# Altium schematic sheet [5] Jetson Nano P1.SchDoc: ARS Camera REV01 Jetson Nano P1
size A3; DrawnBy: Manh Ngo Van; Engineer: Manh Ngo Van; Organization: Altium Limited; Address1: L3, 12a Rodborough Rd; Address2: Frenchs Forest; Address3: NSW; Address4: Australia 2086; DocumentNumber: 5; Revision: 1.0; SheetNumber: 5; SheetTotal: 16
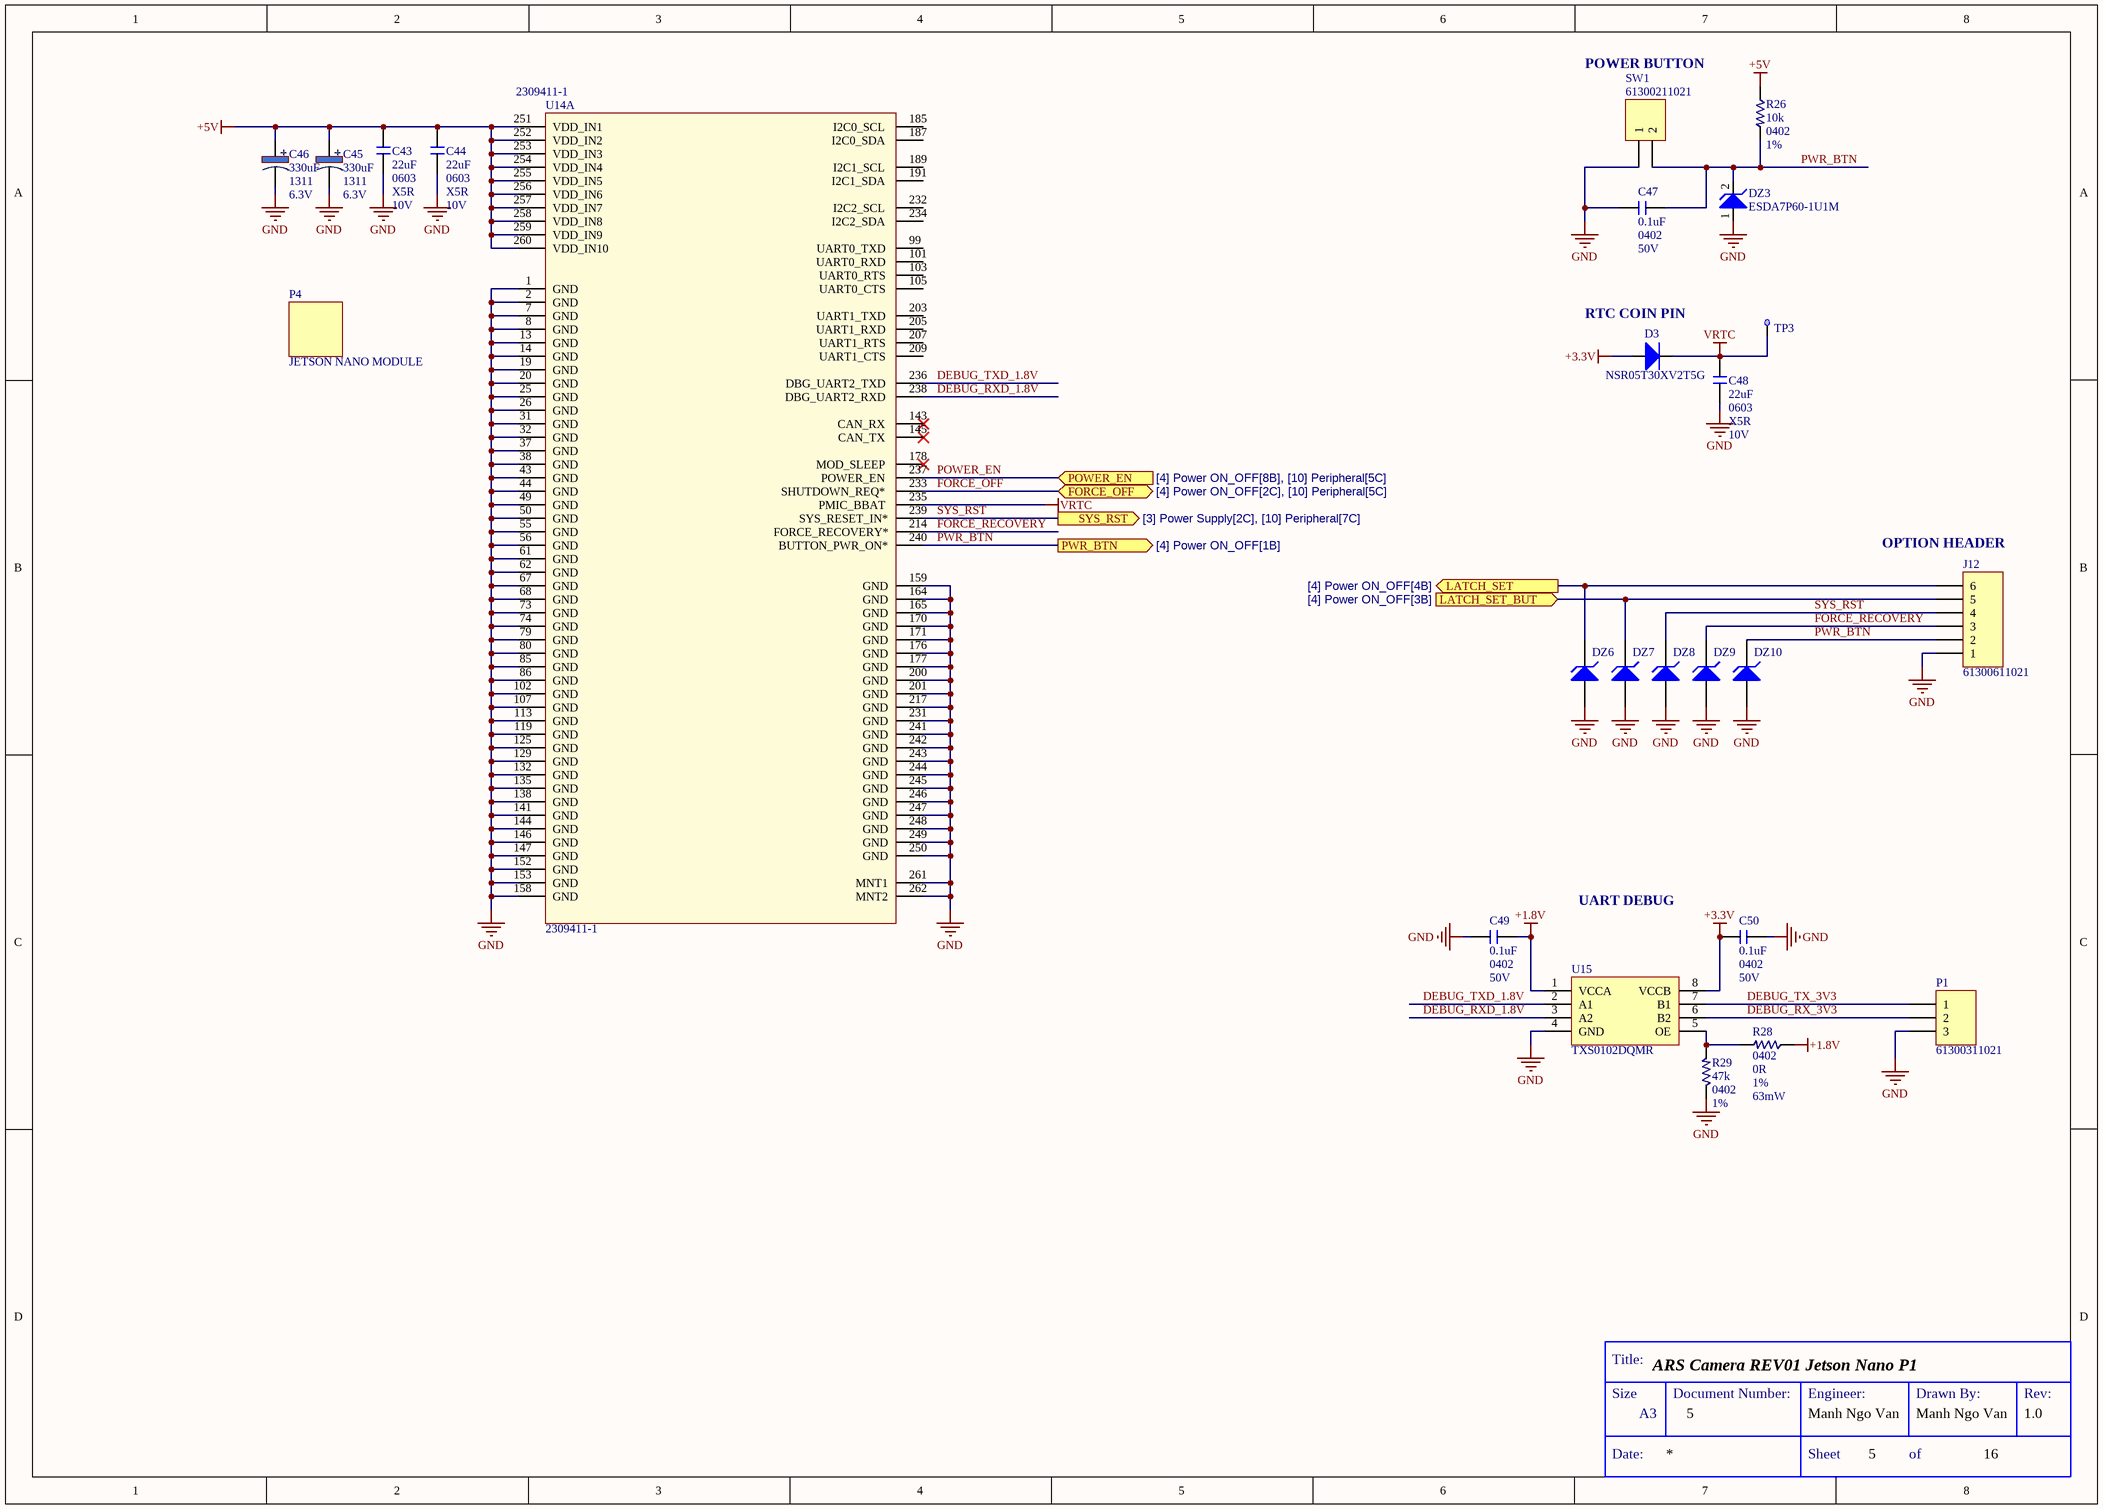
[diagram p0: [5] Jetson Nano P1.SchDoc]

## Parts
C43  22uF  Case Code (Imperial): 0603  Dielectric: X5R  Voltage Rating: 10V  [C0603M]
C44  22uF  Case Code (Imperial): 0603  Dielectric: X5R  Voltage Rating: 10V  [C0603M]
C45  330uF  Case/Package: 1311  Voltage Rating: 6.3V  [CP_TANT_3528]
C46  330uF  Case/Package: 1311  Voltage Rating: 6.3V  [CP_TANT_3528]
C47  0.1uF  Case/Package: 0402  Voltage: 50V  [C0402M]
C48  22uF  Case Code (Imperial): 0603  Dielectric: X5R  Voltage Rating: 10V  [C0603M]
C49  0.1uF  Case/Package: 0402  Voltage: 50V  [C0402M]
C50  0.1uF  Case/Package: 0402  Voltage: 50V  [C0402M]
D3  NSR05T30XV2T5G  [SODFL160X70-2N]
DZ3  ESDA7P60-1U1M  [DFN105P160X60-2N]
DZ6  TPD1E10B06DPYR  [R0402M]  (value not drawn)
DZ7  TPD1E10B06DPYR  [R0402M]  (value not drawn)
DZ8  TPD1E10B06DPYR  [R0402M]  (value not drawn)
DZ9  TPD1E10B06DPYR  [R0402M]  (value not drawn)
DZ10  TPD1E10B06DPYR  [R0402M]  (value not drawn)
J12  61300611021  [HDR1X6]
P1  61300311021  [HDR1X3]
P4  JETSON NANO MODULE  (mechanical)
R26  10k  Case Code (Imperial): 0402  Tolerance: 1%  [R0402M]
R28  Case Code (Imperial): 0402  Resistance: 0R  Tolerance: 1%  Max Power Dissipation: 63mW  [R0402M]  (hidden comment: RC0402FR-070RL)
R29  47k  Case Code (Imperial): 0402  Tolerance: 1%  [R0402M]
SW1  61300211021  [HDR1X2]
TP3  TP  [Test point]  (value not drawn)  (net tie, no BOM)
U14  2309411-1  [2309411-1]  (part A of 3)
U15  TXS0102DQMR  [SON35P100X40-8N]

## Ports
FORCE_OFF (bidir, see [4] Power ON_OFF[2C], [10] Peripheral[5C]), LATCH_SET (out, see [4] Power ON_OFF[4B]), LATCH_SET_BUT (in, see [4] Power ON_OFF[3B]), POWER_EN (in, see [4] Power ON_OFF[8B], [10] Peripheral[5C]), PWR_BTN (out, see [4] Power ON_OFF[1B]), SYS_RST (out, see [3] Power Supply[2C], [10] Peripheral[7C])

## Nets
+1.8V: C49.2 R28.2 U15.1(VCCA)
+3.3V: C50.2 D3.2(A) U15.8(VCCB)
+5V: C43.2 C44.2 C45.1 C46.1 R26.2 U14.251(VDD_IN1) U14.252(VDD_IN2) U14.253(VDD_IN3) U14.254(VDD_IN4) U14.255(VDD_IN5) U14.256(VDD_IN6) U14.257(VDD_IN7) U14.258(VDD_IN8) U14.259(VDD_IN9) U14.260(VDD_IN10)
GND: C43.1 C44.1 C45.2 C46.2 C47.2 C48.1 C49.1 C50.1 DZ3.1(A) DZ6.1(A) DZ7.1(A) DZ8.1(A) DZ9.1(A) DZ10.1(A) J12.1 P1.3 R29.2 SW1.1 U14.1(GND) U14.2(GND) U14.7(GND) U14.8(GND) U14.13(GND) U14.14(GND) U14.19(GND) U14.20(GND) U14.25(GND) U14.26(GND) U14.31(GND) U14.32(GND) U14.37(GND) U14.38(GND) U14.43(GND) U14.44(GND) U14.49(GND) U14.50(GND) U14.55(GND) U14.56(GND) U14.61(GND) U14.62(GND) U14.67(GND) U14.68(GND) U14.73(GND) U14.74(GND) U14.79(GND) U14.80(GND) U14.85(GND) U14.86(GND) U14.102(GND) U14.107(GND) U14.113(GND) U14.119(GND) U14.125(GND) U14.129(GND) U14.132(GND) U14.135(GND) U14.138(GND) U14.141(GND) U14.144(GND) U14.146(GND) U14.147(GND) U14.152(GND) U14.153(GND) U14.158(GND) U14.159(GND) U14.164(GND) U14.165(GND) U14.170(GND) U14.171(GND) U14.176(GND) U14.177(GND) U14.200(GND) U14.201(GND) U14.217(GND) U14.231(GND) U14.241(GND) U14.242(GND) U14.243(GND) U14.244(GND) U14.245(GND) U14.246(GND) U14.247(GND) U14.248(GND) U14.249(GND) U14.250(GND) U14.261(MNT1) U14.262(MNT2) U15.4(GND)
VRTC: C48.2 D3.1(C) TP3.1(TP) U14.235(PMIC_BBAT)
DEBUG_RX_3V3: P1.2 U15.6(B2)
DEBUG_RXD_1.8V: U14.238(DBG_UART2_RXD) U15.3(A2)
DEBUG_TX_3V3: P1.1 U15.7(B1)
DEBUG_TXD_1.8V: U14.236(DBG_UART2_TXD) U15.2(A1)
FORCE_OFF: U14.233(SHUTDOWN_REQ*) ; port FORCE_OFF
FORCE_RECOVERY: DZ9.2(K) J12.3 U14.214(FORCE_RECOVERY*)
LATCH_SET: DZ6.2(K) J12.6 ; port LATCH_SET
LATCH_SET_BUT: DZ7.2(K) J12.5 ; port LATCH_SET_BUT
POWER_EN: U14.237(POWER_EN) ; port POWER_EN
PWR_BTN: C47.1 DZ3.2(K) DZ10.2(K) J12.2 R26.1 SW1.2 U14.240(BUTTON_PWR_ON*) ; port PWR_BTN
SYS_RST: DZ8.2(K) J12.4 U14.239(SYS_RESET_IN*) ; port SYS_RST
NetR28_1: R28.1 R29.1 U15.5(OE)

Not connected (* = marked no-connect by the designer): U14 99(UART0_TXD) 101(UART0_RXD) 103(UART0_RTS) 105(UART0_CTS) 143(CAN_RX)* 145(CAN_TX)* 178(MOD_SLEEP)* 185(I2C0_SCL) 187(I2C0_SDA) 189(I2C1_SCL) 191(I2C1_SDA) 203(UART1_TXD) 205(UART1_RXD) 207(UART1_RTS) 209(UART1_CTS) 232(I2C2_SCL) 234(I2C2_SDA)

## Notes on the sheet
- POWER BUTTON
- (near D3) RTC COIN PIN
- (near J12) OPTION HEADER
- UART DEBUG
- Title:
- Size
- Document Number:
- Engineer:
- Drawn By:
- Rev:
- Date:
- A3
- Sheet
- of

## Library data of the parts
C43 C44 C48 = CAP_CER: CAP CER 22UF 10V X5R 0603; Manufacturer: Samsung; Manufacturer Part Number: CL10A226MP8NUNE; Tolerance: 20%; Supplier 1: Digi-Key; Supplier Part Number 1: 1276-1274-1-ND; Stock 1: 62306; Pricing 1: 1 = 0.20000, 10 = 0.14300, 50 = 0.08100, 100 = 0.06720, 500 = 0.04710, 1000 = 0.03900 (USD); RoHS: Yes; Mount: Surface Mount; Case/Package: 0603; Case Code (Metric): 1608; Contact Plating: Tin; Min Operating Temperature: -55°C; Max Operating Temperature: 85°C; Packaging: Tape and Reel; Capacitance: 22uF; Length: 1.6mm; Width: 0.031inch; Height: 0.8mm; Thickness: 0.035inch; Depth: 0.8mm; Radiation Hardening: No; Lead Free: Lead Free; ComponentLink1URL: https://datasheet.ciiva.com/26838/getdatasheetpartid-746477-26838370.pdf?src-supplier=Verical; ComponentLink1Description: https://datasheet.ciiva.com/26838/getdatasheetpartid-746477-26838370.pdf?src-supplier=Verical; ComponentLink2URL: https://datasheet.ciiva.com/25711/cl10a226mp8nune-25711532.pdf?src-supplier=Digi-Key; ComponentLink2Description: https://datasheet.ciiva.com/25711/cl10a226mp8nune-25711532.pdf?src-supplier=Digi-Key
C45 C46 = CAP_PL: CAP TANT 330UF 20% 6.3V 1311; Manufacturer: KEMET; Manufacturer Part Number: T520B337M006ATE070; ESR (Equivalent Series Resistance): 700mR; Polarity: Polar; Dissipation Factor: 15%; Resistance: 0.07R; Life (Hours): 2000Hour; Supplier 1: Digi-Key; Supplier Part Number 1: 399-18631-1-ND; Stock 1: 1375; Pricing 1: 1 = 1.67000, 10 = 1.31700, 50 = 1.14120, 100 = 0.98750, 500 = 0.74614, 1000 = 0.65835 (USD); RoHS: Yes; Mount: Surface Mount; Number of Pins: 2; Case Code (Metric): 3528; Case Code (Imperial): 1411; Weight: 0.002293oz; Min Operating Temperature: -55°C; Max Operating Temperature: 125°C; Capacitance: 330uF; Tolerance: 20%; Packaging: Tape and Reel; Package Quantity: 1; Termination: SMD/SMT; Voltage Rating (DC): 6.3V; Features: General Purpose; Length: 3.5mm; Width: 0.11inch; Height: 2.8mm; Depth: 2.8mm; Height - Seated (Max): 0.083inch; Radiation Hardening: No; Lead Free: Lead Free; REACH SVHC: No SVHC; ComponentLink1URL: https://datasheet.ciiva.com/22691/1744555-22691447.pdf?src-supplier=Element14; ComponentLink1Description: https://datasheet.ciiva.com/22691/1744555-22691447.pdf?src-supplier=Element14
C47 C49 C50 = CAP_CER: CAP CER 0.1UF 50V X7R 0402; Manufacturer: Murata; Manufacturer Part Number: GRM155R71H104KE14D; Material: Ceramic; Tolerance: 10%; Capacitance: 100nF; Dissipation Factor: 0.025%; ComponentLink1URL: https://datasheet.ciiva.com/25741/cl10b104kb8nnnl-25741341.pdf?src-supplier=Digi-Key; ComponentLink1Description: https://datasheet.ciiva.com/25741/cl10b104kb8nnnl-25741341.pdf?src-supplier=Digi-Key; ComponentLink2URL: https://datasheet.ciiva.com/26838/getdatasheetpartid-357523-26838415.pdf?src-supplier=Verical; ComponentLink2Description: https://datasheet.ciiva.com/26838/getdatasheetpartid-357523-26838415.pdf?src-supplier=Verical; Supplier 1: Digi-Key; Supplier Part Number 1: 490-10700-1-ND; Stock 1: 2282266; Pricing 1: 1 = 0.10000, 10 = 0.04600, 100 = 0.02050, 500 = 0.01464, 1000 = 0.01150, 2500 = 0.01045, 5000 = 0.00961 (USD); RoHS: Yes; Mount: Surface Mount; Weight: 0.000212oz; Case Code (Metric): 1005; Case Code (Imperial): 0402; Dielectric Material: Ceramic; Min Operating Temperature: -55°C; Max Operating Temperature: 125°C; Packaging: Tape and Reel; Dielectric: X7R; Voltage Rating: 50V; Termination: SMD/SMT; Composition: Ceramic; Voltage Rating (DC): 50V; Package Quantity: 10000; Length: 1mm; Height: 0.5mm; Width: 0.5mm; Thickness: 0.022inch; Depth: 0.5mm; REACH SVHC: No SVHC; Lead Free: Lead Free; ComponentLink3URL: http://www.farnell.com/datasheets/2079156.pdf?src-supplier=Farnell; ComponentLink3Description: http://www.farnell.com/datasheets/2079156.pdf?src-supplier=Farnell; ComponentLink4URL: http://www.mouser.com/ds/2/281/c02e-2905.pdf?src-supplier=Mouser; ComponentLink4Description: http://www.mouser.com/ds/2/281/c02e-2905.pdf?src-supplier=Mouser; ComponentLink5URL: http://components.arrow.com/part/dataview/0323_07030614?src-supplier=Arrow+Europe; ComponentLink5Description: http://components.arrow.com/part/dataview/0323_07030614?src-supplier=Arrow+Europe; ComponentLink6URL: https://search.murata.co.jp/Ceramy/image/img/A01X/G101/ENG/GRM155R71H104KE14-01.pdf?src-supplier=Digi-Key; ComponentLink6Description: https://search.murata.co.jp/Ceramy/image/img/A01X/G101/ENG/GRM155R71H104KE14-01.pdf?src-supplier=Digi-Key; ComponentLink7URL: http://psearch.en.murata.com/capacitor/product/GRM155R71H104KE14%23.pdf?src-supplier=Avnet; ComponentLink7Description: http://psearch.en.murata.com/capacitor/product/GRM155R71H104KE14%23.pdf?src-supplier=Avnet; ComponentLink8URL: http://www.farnell.com/datasheets/2079156.pdf?src-supplier=Element14; ComponentLink8Description: http://www.farnell.com/datasheets/2079156.pdf?src-supplier=Element14; ComponentLink9URL: http://www.farnell.com/datasheets/2079156.pdf?src-supplier=Newark; ComponentLink9Description: http://www.farnell.com/datasheets/2079156.pdf?src-supplier=Newark
D3 = Diode: DIODE SCHOTTKY 30V 500MA SOD523; Manufacturer: ON Semiconductor; Reverse Recovery Time: 23ns; Supplier 1: Digi-Key; Supplier Part Number 1: NSR05T30XV2T5GOSCT-ND; Manufacturer Part Number: NSR05T30XV2T5G; Stock 1: 9501; Pricing 1: 1 = 0.32000, 10 = 0.25800, 100 = 0.10560, 500 = 0.08808, 1000 = 0.06120, 2000 = 0.05688 (USD); RoHS: No; Mount: Surface Mount; Packaging: Cut Tape; Max Reverse Voltage (DC): 30V; Average Rectified Current: 500mA; ComponentLink1URL: http://www.farnell.com/datasheets/2339385.pdf?src-supplier=Farnell; ComponentLink1Description: http://www.farnell.com/datasheets/2339385.pdf?src-supplier=Farnell; ComponentLink2URL: http://www.onsemi.com/pub/Collateral/NSR05T30XV2-D.PDF?src-supplier=Digi-Key; ComponentLink2Description: http://www.onsemi.com/pub/Collateral/NSR05T30XV2-D.PDF?src-supplier=Digi-Key
DZ3 = ESDA7P60-1U1M: TVS DIODE 5V 11.6V 1610; Manufacturer: STMicroelectronics; Number of Unidirectional Channels: 1; Min Breakdown Voltage: 6.4V; Peak Pulse Power: 700W; Power Line Protection: No; Polarity: Unidirectional; Max Breakdown Voltage: 7.2V; Peak Pulse Current: 60A; ComponentLink1URL: https://datasheet.ciiva.com/26005/sllseb1b-26005840.pdf?src-supplier=Avnet+Europe; ComponentLink1Description: https://datasheet.ciiva.com/26005/sllseb1b-26005840.pdf?src-supplier=Avnet+Europe; ComponentLink2URL: https://datasheet.ciiva.com/46384/1877100-46384054.pdf?src-supplier=Element14; ComponentLink2Description: https://datasheet.ciiva.com/46384/1877100-46384054.pdf?src-supplier=Element14; ComponentLink3URL: https://datasheet.ciiva.com/14195/tpd1e10b06-14195178.pdf?src-supplier=Avnet; ComponentLink3Description: https://datasheet.ciiva.com/14195/tpd1e10b06-14195178.pdf?src-supplier=Avnet; ComponentLink4URL: https://datasheet.ciiva.com/22691/1877100-22691786.pdf?src-supplier=Element14; ComponentLink4Description: https://datasheet.ciiva.com/22691/1877100-22691786.pdf?src-supplier=Element14; ComponentLink5URL: https://datasheet.ciiva.com/2961/tpd1e10b06-2961245.pdf?src-supplier=Digi-Key; ComponentLink5Description: https://datasheet.ciiva.com/2961/tpd1e10b06-2961245.pdf?src-supplier=Digi-Key; ComponentLink6URL: https://datasheet.ciiva.com/2961/tpd1e10b06-2961246.pdf?src-supplier=Digi-Key; ComponentLink6Description: https://datasheet.ciiva.com/2961/tpd1e10b06-2961246.pdf?src-supplier=Digi-Key; ComponentLink7URL: https://datasheet.ciiva.com/6574/tpd1e10b06-6574654.pdf?src-supplier=Digi-Key; ComponentLink7Description: https://datasheet.ciiva.com/6574/tpd1e10b06-6574654.pdf?src-supplier=Digi-Key; Supplier 1: Digi-Key; Manufacturer Part Number: ESDA7P60-1U1M; Stock 1: 43399; Pricing 1: 1 = 0.36000, 10 = 0.25900, 100 = 0.13050, 500 = 0.11566, 1000 = 0.09000, 2000 = 0.08055 (USD); RoHS: Yes; Mount: Surface Mount; Case/Package: 1610; Number of Pins: 2; Min Operating Temperature: -55°C; Max Operating Temperature: 150°C; Packaging: Cut Tape; Reverse Standoff Voltage: 5V; Clamping Voltage: 11.6V; Resistor Type: Zener; REACH SVHC: No SVHC; ComponentLink8URL: http://www.farnell.com/datasheets/2041290.pdf?src-supplier=Farnell; ComponentLink8Description: http://www.farnell.com/datasheets/2041290.pdf?src-supplier=Farnell; ComponentLink9URL: http://www.st.com/content/ccc/resource/technical/document/datasheet/44/e9/26/44/42/ee/4f/e5/DM00139972.pdf/files/DM00139972.pdf/jcr:content/translations/en.DM00139972.pdf?src-supplier=Digi-Key; ComponentLink9Description: http://www.st.com/content/ccc/resource/technical/document/datasheet/44/e9/26/44/42/ee/4f/e5/DM00139972.pdf/files/DM00139972.pdf/jcr:content/translations/en.DM00139972.pdf?src-supplier=Digi-Key; ComponentLink10URL: http://www.farnell.com/datasheets/2041290.pdf?src-supplier=Element14; ComponentLink10Description: http://www.farnell.com/datasheets/2041290.pdf?src-supplier=Element14; Supplier Part Number 1: 497-16253-1-ND
DZ6-DZ10 = D Zener: TVS DIODE 5.5V 14V 2X1SON; Manufacturer: Texas Instruments; Capacitance: 12pF; Direction: Bidirectional; Breakdown Voltage: 6V; Number of Channels: 1; Peak Pulse Power: 90W; Power Line Protection: No; Leakage Current: 100nA; ESD Protection: Yes; Test Current: 1mA; Element Configuration: Single; Peak Pulse Current: 5A; Interface: GPIO; Supplier 1: Digi-Key; Supplier Part Number 1: 296-30406-1-ND; Manufacturer Part Number: TPD1E10B06DPYR; Stock 1: 555750; Pricing 1: 1 = 0.45000, 10 = 0.29400, 100 = 0.16380, 500 = 0.10920, 1000 = 0.07560, 5000 = 0.07350 (USD); RoHS: Yes; Case/Package: 0402; Number of Pins: 2; Contact Plating: Gold; Min Operating Temperature: -40°C; Max Operating Temperature: 125°C; Package Quantity: 1; Packaging: Tape and Reel; Number of Bidirectional Channels: 1; Reverse Standoff Voltage: 5.5V; Min Breakdown Voltage: 6V; Clamping Voltage: 14V; Working Voltage: 5.5V; Max Reverse Leakage Current: 100nA; Resistor Type: Zener; Length: 1.1mm; Height: 0.35mm; Width: 0.7mm; Radiation Hardening: No; REACH SVHC: No SVHC; Lead Free: Lead Free; ComponentLink1URL: https://datasheet.ciiva.com/26005/sllseb1b-26005840.pdf?src-supplier=Avnet+Europe; ComponentLink1Description: https://datasheet.ciiva.com/26005/sllseb1b-26005840.pdf?src-supplier=Avnet+Europe; ComponentLink2URL: https://datasheet.ciiva.com/46384/1877100-46384054.pdf?src-supplier=Element14; ComponentLink2Description: https://datasheet.ciiva.com/46384/1877100-46384054.pdf?src-supplier=Element14; ComponentLink3URL: https://datasheet.ciiva.com/14195/tpd1e10b06-14195178.pdf?src-supplier=Avnet; ComponentLink3Description: https://datasheet.ciiva.com/14195/tpd1e10b06-14195178.pdf?src-supplier=Avnet; ComponentLink4URL: https://datasheet.ciiva.com/22691/1877100-22691786.pdf?src-supplier=Element14; ComponentLink4Description: https://datasheet.ciiva.com/22691/1877100-22691786.pdf?src-supplier=Element14; ComponentLink5URL: https://datasheet.ciiva.com/2961/tpd1e10b06-2961245.pdf?src-supplier=Digi-Key; ComponentLink5Description: https://datasheet.ciiva.com/2961/tpd1e10b06-2961245.pdf?src-supplier=Digi-Key; ComponentLink6URL: https://datasheet.ciiva.com/2961/tpd1e10b06-2961246.pdf?src-supplier=Digi-Key; ComponentLink6Description: https://datasheet.ciiva.com/2961/tpd1e10b06-2961246.pdf?src-supplier=Digi-Key; ComponentLink7URL: https://datasheet.ciiva.com/6574/tpd1e10b06-6574654.pdf?src-supplier=Digi-Key; ComponentLink7Description: https://datasheet.ciiva.com/6574/tpd1e10b06-6574654.pdf?src-supplier=Digi-Key
J12 = Header 6: CONN HEADER R/A 6POS 2.54MM; Manufacturer: Würth Elektronik GmbH; Manufacturer Part Number: 61300611021; Supplier 1: RSComponents; Supplier Part Number 1: 8281660
P1 = Header 3: CONN HEADER R/A 3POS 2.54MM; Manufacturer: Würth Elektronik GmbH; Manufacturer Part Number: 61300311021; Supplier 1: RSComponents; Supplier Part Number 1: 8281654P
P4 = ADDITION: Manufacturer 1: NVIDIA; Manufacturer Part Number 1: JETSON NANO MODULE
R26 = RES_SMD: RES SMD 10K OHM 1% 1/16W 0402; Manufacturer: Yageo; Manufacturer Part Number: RC0402FR-0710KL; Resistance: 10kR; Temperature Coefficient: 100ppm/°C; Voltage Rating (DC): 50V; Power Rating: 62.5mW; Supplier 1: Digi-Key; Supplier Part Number 1: 311-10.0KLRTR-ND; Stock 1: 58760000; Pricing 1: 10000 = 0.001630, 30000 = 0.001440, 50000 = 0.001320, 100000 = 0.001290 (USD); RoHS: Yes; Case/Package: 0402; Number of Pins: 2; Case Code (Metric): 1005; Min Operating Temperature: -55°C; Max Operating Temperature: 155°C; Composition: Thick Film; Packaging: Tape and Reel; Voltage Rating: 50V; Termination: SMD/SMT; Military Standard: Not; Working Voltage: 50V; Number of Terminations: 2; Length: 1mm; Height: 0.32mm; Width: 0.5mm; Depth: 0.5mm; Lead Pitch: 0.2mm; REACH SVHC: No SVHC; Lead Free: Lead Free; ComponentLink1URL: https://datasheet.ciiva.com/7660/38568-7660787.pdf?src-supplier=Element14; ComponentLink1Description: https://datasheet.ciiva.com/7660/38568-7660787.pdf?src-supplier=Element14; ComponentLink2URL: https://datasheet.ciiva.com/7849/1784430-7849813.pdf?src-supplier=Element14; ComponentLink2Description: https://datasheet.ciiva.com/7849/1784430-7849813.pdf?src-supplier=Element14; ComponentLink3URL: https://datasheet.ciiva.com/7849/1686128-7849814.pdf?src-supplier=Element14; ComponentLink3Description: https://datasheet.ciiva.com/7849/1686128-7849814.pdf?src-supplier=Element14; ComponentLink4URL: https://datasheet.ciiva.com/7849/1784430-7849815.pdf?src-supplier=Element14; ComponentLink4Description: https://datasheet.ciiva.com/7849/1784430-7849815.pdf?src-supplier=Element14; ComponentLink5URL: https://datasheet.ciiva.com/22747/1018594-22747512.pdf?src-supplier=Element14; ComponentLink5Description: https://datasheet.ciiva.com/22747/1018594-22747512.pdf?src-supplier=Element14; ComponentLink6URL: https://datasheet.ciiva.com/12667/pyu-rc0402-51-rohs-l-6-r-12667067.pdf?src-supplier=Mouser; ComponentLink6Description: https://datasheet.ciiva.com/12667/pyu-rc0402-51-rohs-l-6-r-12667067.pdf?src-supplier=Mouser; ComponentLink7URL: https://datasheet.ciiva.com/7983/1018594-7983486.pdf?src-supplier=Element14; ComponentLink7Description: https://datasheet.ciiva.com/7983/1018594-7983486.pdf?src-supplier=Element14
R28 = RES_SMD: RC Series 0402 0.063 W 0 Ohm Jumper Surface Mount Thick Film Chip Resistor; Manufacturer 1: Yageo; Power Rating: 62.5mW; Voltage Rating: 50V; Temperature Coefficient: 200ppm/°C; Supplier 1: Digi-Key; Supplier Part Number 1: 311-0.0LRCT-ND; Manufacturer Part Number 1: RC0402FR-070RL; Stock 1: 2177900; Pricing 1: 1=0.10000, 10=0.01200, 25=0.00840, 50=0.00640, 100=0.00470, 250=0.00360, 500=0.00288, 1000=0.00212, 5000=0.00152 (USD); RoHS: Yes; Mount: Surface Mount; Case/Package: 0402; Contact Plating: Tin,Matte; Case Code (Metric): 1005; Size Code: 0402; Min Operating Temperature: -55°C; Max Operating Temperature: 155°C; Resistor Type: Thick Film; Packaging: Tape and Reel; Termination: SMD/SMT; Features: Moisture Resistant; Series: RC; Number of Terminations: 2; Length: 1mm; Width: 0.5mm; Height: 0.35mm; Radiation Hardening: No; Lead Free: Lead Free; RoHS Compliant: Yes; ComponentLink1URL: https://datasheet.ciiva.com/8896/pyu-rc0402-51-rohs-l-6-8896149.pdf?src-supplier=Avnet; ComponentLink1Description: https://datasheet.ciiva.com/8896/pyu-rc0402-51-rohs-l-6-8896149.pdf?src-supplier=Avnet; ComponentLink2URL: https://datasheet.ciiva.com/16790/pyu-rc0402-51-rohs-l-6-r-16790444.pdf?src-supplier=Future+Electronics; ComponentLink2Description: https://datasheet.ciiva.com/16790/pyu-rc0402-51-rohs-l-6-r-16790444.pdf?src-supplier=Future+Electronics; ComponentLink3URL: https://datasheet.ciiva.com/28419/pyu-rc0402-51-rohs-l-6-28419661.pdf?src-supplier=Avnet+Europe; ComponentLink3Description: https://datasheet.ciiva.com/28419/pyu-rc0402-51-rohs-l-6-28419661.pdf?src-supplier=Avnet+Europe; ComponentLink4URL: https://datasheet.ciiva.com/16869/pyu-rc0402-51-rohs-l-6-16869518.pdf?src-supplier=Avnet+Europe; ComponentLink4Description: https://datasheet.ciiva.com/16869/pyu-rc0402-51-rohs-l-6-16869518.pdf?src-supplier=Avnet+Europe
R29 = RES_SMD: RES SMD 47K OHM 1% 1/16W 0402; Manufacturer: Yageo; Manufacturer Part Number: RC0402FR-0747KL; Power Rating: 62.5mW; Temperature Coefficient: 100ppm/°C; Voltage Rating: 50V; Resistance: 47kR; Max Power Dissipation: 63mW; Supplier 1: Digi-Key; Supplier Part Number 1: 311-47.0KLRCT-ND; Stock 1: 5593658; Pricing 1: 1 = 0.10000, 10 = 0.01400, 100 = 0.00580, 1000 = 0.00260, 2500 = 0.00226, 5000 = 0.00186 (USD); RoHS: Yes; Case/Package: 0402; Case Code (Metric): 1005; Min Operating Temperature: -55°C; Max Operating Temperature: 155°C; Packaging: Tape and Reel; Package Quantity: 1; Termination: SMD/SMT; Resistor Type: Thick Film; Number of Terminations: 2; Features: Moisture Resistant; Length: 1mm; Width: 0.5mm; Height: 0.016inch; Depth: 0.5mm; REACH SVHC: Unknown; Military Standard: Not; Lead Free: Lead Free; ComponentLink1URL: https://datasheet.ciiva.com/16793/pyu-rc0402-51-rohs-l-6-r-16793430.pdf?src-supplier=Future+Electronics; ComponentLink1Description: https://datasheet.ciiva.com/16793/pyu-rc0402-51-rohs-l-6-r-16793430.pdf?src-supplier=Future+Electronics; ComponentLink2URL: https://datasheet.ciiva.com/46412/1018594-46412839.pdf?src-supplier=Element14; ComponentLink2Description: https://datasheet.ciiva.com/46412/1018594-46412839.pdf?src-supplier=Element14; ComponentLink3URL: https://datasheet.ciiva.com/15189/getdatasheetpartid-323748-15189466.pdf?src-supplier=Verical; ComponentLink3Description: https://datasheet.ciiva.com/15189/getdatasheetpartid-323748-15189466.pdf?src-supplier=Verical; ComponentLink4URL: https://datasheet.ciiva.com/2453/pyu-r-int-thick-7-2453388.pdf?src-supplier=Digi-Key; ComponentLink4Description: https://datasheet.ciiva.com/2453/pyu-r-int-thick-7-2453388.pdf?src-supplier=Digi-Key; ComponentLink5URL: https://datasheet.ciiva.com/2453/pyu-r-int-thick-7-2453389.pdf?src-supplier=Digi-Key; ComponentLink5Description: https://datasheet.ciiva.com/2453/pyu-r-int-thick-7-2453389.pdf?src-supplier=Digi-Key; ComponentLink6URL: https://datasheet.ciiva.com/2453/pyu-r-int-thick-7-2453390.pdf?src-supplier=Digi-Key; ComponentLink6Description: https://datasheet.ciiva.com/2453/pyu-r-int-thick-7-2453390.pdf?src-supplier=Digi-Key
SW1 = Header 2: CONN HEADER R/A 2POS 2.54MM; Manufacturer: Würth Elektronik GmbH; Manufacturer Part Number: 61300211021; Supplier 1: RSComponents; Supplier Part Number 1: 8281651
TP3 = TestPoint
U14 = Jetson Nano SODIMM: DDR4 SODIMM 260P 8.0H STD; Manufacturer: TE Connectivity; Contact Current Rating: 500mA; Circuit Application: Power; Connector System: Cable-to-Board; Number of Positions: 260; PCB Mount Retention: With; Sealable: No (Without); Row Spacing: 0.322inch; Pitch: 2.1mm; Stack Height: 0.157inch; Manufacturer Part Number: 2309411-1; RoHS: Yes; Category: Memory Connectors; Stock 1: 7189; Pricing 1: 1=1.40000, 10=1.22700, 25=1.15520, 50=1.10700, 100=1.05890 (USD); Mount: Surface Mount; Contact Plating: Gold; Contact Material: Copper Alloy; Housing Color: Black; Housing Material: Thermoplastic; Min Operating Temperature: -67°C; Max Operating Temperature: 185°C; Number of Rows: 2; Packaging: Tape and Reel; Package Quantity: 900; Flammability Rating: UL94 V-0; RoHS Compliant: Yes; ComponentLink1URL: https://www.te.com/commerce/DocumentDelivery/DDEController?Action=srchrtrv&amp;DocNm=2309407&amp;DocType=Customer+Drawing&amp;DocLang=English&src-supplier=Digi-Key; ComponentLink1Description: https://www.te.com/commerce/DocumentDelivery/DDEController?Action=srchrtrv&amp;DocNm=2309407&amp;DocType=Customer+Drawing&amp;DocLang=English&src-supplier=Digi-Key; ComponentLink2URL: https://www.te.com/commerce/DocumentDelivery/DDEController?Action=srchrtrv&DocNm=2309407&DocType=Customer+Drawing&DocLang=English&src-supplier=Digi-Key; ComponentLink2Description: https://www.te.com/commerce/DocumentDelivery/DDEController?Action=srchrtrv&DocNm=2309407&DocType=Customer+Drawing&DocLang=English&src-supplier=Digi-Key; Supplier 1: Arrow Electronics; Supplier Part Number 1: 2309411-1
U15 = TXS0102DQMR: IC TRNSLTR BIDIRECTIONAL 8X2SON; Manufacturer: Texas Instruments; Max Supply Voltage: 5.5V; Min Supply Voltage: 1.65V; Propagation Delay: 260ns; Data Rate: 24Mbps; Number of Channels: 2; Logic Function: Translator; Turn-On Delay Time: 4.6ns; Low Level Output Current: 1mA; High Level Output Current: -20uA; Output Type: Voltage; Quiescent Current: 14.4uA; Supplier 1: Digi-Key; Supplier Part Number 1: 296-28435-1-ND; Manufacturer Part Number: TXS0102DQMR; RoHS: Yes; Category: Voltage Level Shifters; Stock 1: 6461; Pricing 1: 1=0.74000, 10=0.64700, 25=0.60800, 100=0.49610, 250=0.46084, 500=0.39220, 1000=0.30895 (USD); Mount: Surface Mount; Number of Pins: 8; Contact Plating: Gold; Min Operating Temperature: -40°C; Max Operating Temperature: 85°C; Packaging: Tape and Reel; Package Quantity: 1; Number of Bits: 2; Series: -; Number of Inputs: 2; Length: 1.85mm; Width: 1.25mm; Height: 0.35mm; Radiation Hardening: No; REACH SVHC: No SVHC; Lead Free: Lead Free; RoHS Compliant: Yes; ComponentLink1URL: https://datasheet.ciiva.com/15096/getdatasheetpartid-544149-15096438.pdf?src-supplier=Verical; ComponentLink1Description: https://datasheet.ciiva.com/15096/getdatasheetpartid-544149-15096438.pdf?src-supplier=Verical; ComponentLink2URL: https://datasheet.ciiva.com/1900/txs0102-1900696.pdf?src-supplier=Digi-Key; ComponentLink2Description: https://datasheet.ciiva.com/1900/txs0102-1900696.pdf?src-supplier=Digi-Key; ComponentLink3URL: https://datasheet.ciiva.com/1900/txs0102-1900697.pdf?src-supplier=Digi-Key; ComponentLink3Description: https://datasheet.ciiva.com/1900/txs0102-1900697.pdf?src-supplier=Digi-Key; ComponentLink4URL: https://datasheet.ciiva.com/1900/txs0102-1900698.pdf?src-supplier=Digi-Key; ComponentLink4Description: https://datasheet.ciiva.com/1900/txs0102-1900698.pdf?src-supplier=Digi-Key